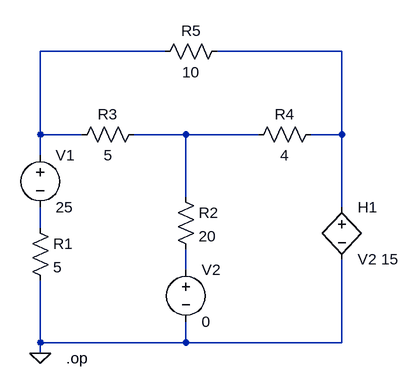
[diagram p0: schematic CH03-KP2-11.asc]
CH03-KP2-11.asc, the LTspice schematic file:
Version 4
SHEET 1 880 696
WIRE 112 208 -80 208
WIRE 384 208 192 208
WIRE -80 336 -80 208
WIRE -16 336 -80 336
WIRE 144 336 64 336
WIRE 256 336 144 336
WIRE 384 336 384 208
WIRE 384 336 336 336
WIRE -80 368 -80 336
WIRE 144 432 144 336
WIRE 384 448 384 336
WIRE -80 480 -80 448
WIRE 144 544 144 512
WIRE -80 656 -80 560
WIRE 144 656 144 624
WIRE 144 656 -80 656
WIRE 384 656 384 528
WIRE 384 656 144 656
WIRE -80 672 -80 656
FLAG -80 672 0
SYMBOL res -96 464 R0
SYMATTR InstName R1
SYMATTR Value 5
SYMBOL res 128 416 R0
SYMATTR InstName R2
SYMATTR Value 20
SYMBOL res 80 320 R90
WINDOW 0 0 56 VBottom 2
WINDOW 3 32 56 VTop 2
SYMATTR InstName R3
SYMATTR Value 5
SYMBOL res 352 320 R90
WINDOW 0 0 56 VBottom 2
WINDOW 3 32 56 VTop 2
SYMATTR InstName R4
SYMATTR Value 4
SYMBOL res 208 192 R90
WINDOW 0 0 56 VBottom 2
WINDOW 3 32 56 VTop 2
SYMATTR InstName R5
SYMATTR Value 10
SYMBOL voltage -80 352 R0
SYMATTR InstName V1
SYMATTR Value 25
SYMBOL voltage 144 528 R0
SYMATTR InstName V2
SYMATTR Value 0
SYMBOL h 384 432 R0
SYMATTR InstName H1
SYMATTR Value V2 15
TEXT -40 680 Left 2 !.op

The netlist it stands for:
* CH03-KP2-11.asc
R1 N004 0 5
R2 N003 N005 20
R3 N003 N001 5
R4 N002 N003 4
R5 N002 N001 10
V1 N001 N004 25
V2 N005 0 0
H1 N002 0 V2 15
.op
.backanno
.end